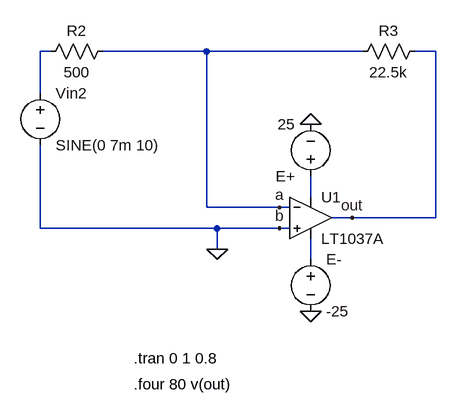
[diagram p0: schematic 3.asc]
3.asc, the LTspice schematic file:
Version 4
SHEET 1 880 680
WIRE -128 -288 -144 -288
WIRE 112 -288 -48 -288
WIRE 352 -288 112 -288
WIRE 464 -288 432 -288
WIRE -144 -224 -144 -288
WIRE 272 -64 272 -96
WIRE 112 -48 112 -288
WIRE 224 -48 112 -48
WIRE 240 -48 224 -48
WIRE 336 -32 304 -32
WIRE 464 -32 464 -288
WIRE 464 -32 336 -32
WIRE -144 -16 -144 -144
WIRE 128 -16 -144 -16
WIRE 224 -16 128 -16
WIRE 240 -16 224 -16
WIRE 128 16 128 -16
WIRE 272 32 272 0
FLAG 272 112 0
FLAG 272 -176 0
FLAG 224 -48 a
FLAG 224 -16 b
FLAG 336 -32 out
FLAG 128 16 0
SYMBOL Opamps\\LT1037A 272 -96 R0
SYMATTR InstName U1
SYMBOL voltage -144 -240 R0
WINDOW 123 0 0 Left 2
WINDOW 39 0 0 Left 2
SYMATTR InstName Vin2
SYMATTR Value SINE(0 7m 10)
SYMBOL voltage 272 -80 R180
WINDOW 123 0 0 Left 2
WINDOW 39 0 0 Left 2
SYMATTR InstName E+
SYMATTR Value 25
SYMBOL voltage 272 16 R0
WINDOW 123 0 0 Left 2
WINDOW 39 0 0 Left 2
SYMATTR InstName E-
SYMATTR Value -25
SYMBOL res -32 -304 R90
WINDOW 0 0 56 VBottom 2
WINDOW 3 32 56 VTop 2
SYMATTR InstName R2
SYMATTR Value 500
SYMBOL res 448 -304 R90
WINDOW 0 0 56 VBottom 2
WINDOW 3 32 56 VTop 2
SYMATTR InstName R3
SYMATTR Value 22.5k
TEXT 0 184 Left 2 !.tran 0 1 0.8
TEXT 0 224 Left 2 !.four 80 v(out)

The netlist it stands for:
* 3.asc
XU1 0 a N002 N003 out LT1037A  ; pins In+ In- V+ V- OUT
Vin2 N001 0 SINE(0 7m 10)
V§E+ N002 0 25
V§E- N003 0 -25
R2 a N001 500
R3 out a 22.5k
.tran 0 1 0.8
.four 80 v(out)
.backanno
.end